# EAGLE design Encoder_Breakout (EAGLE 8.6.0)
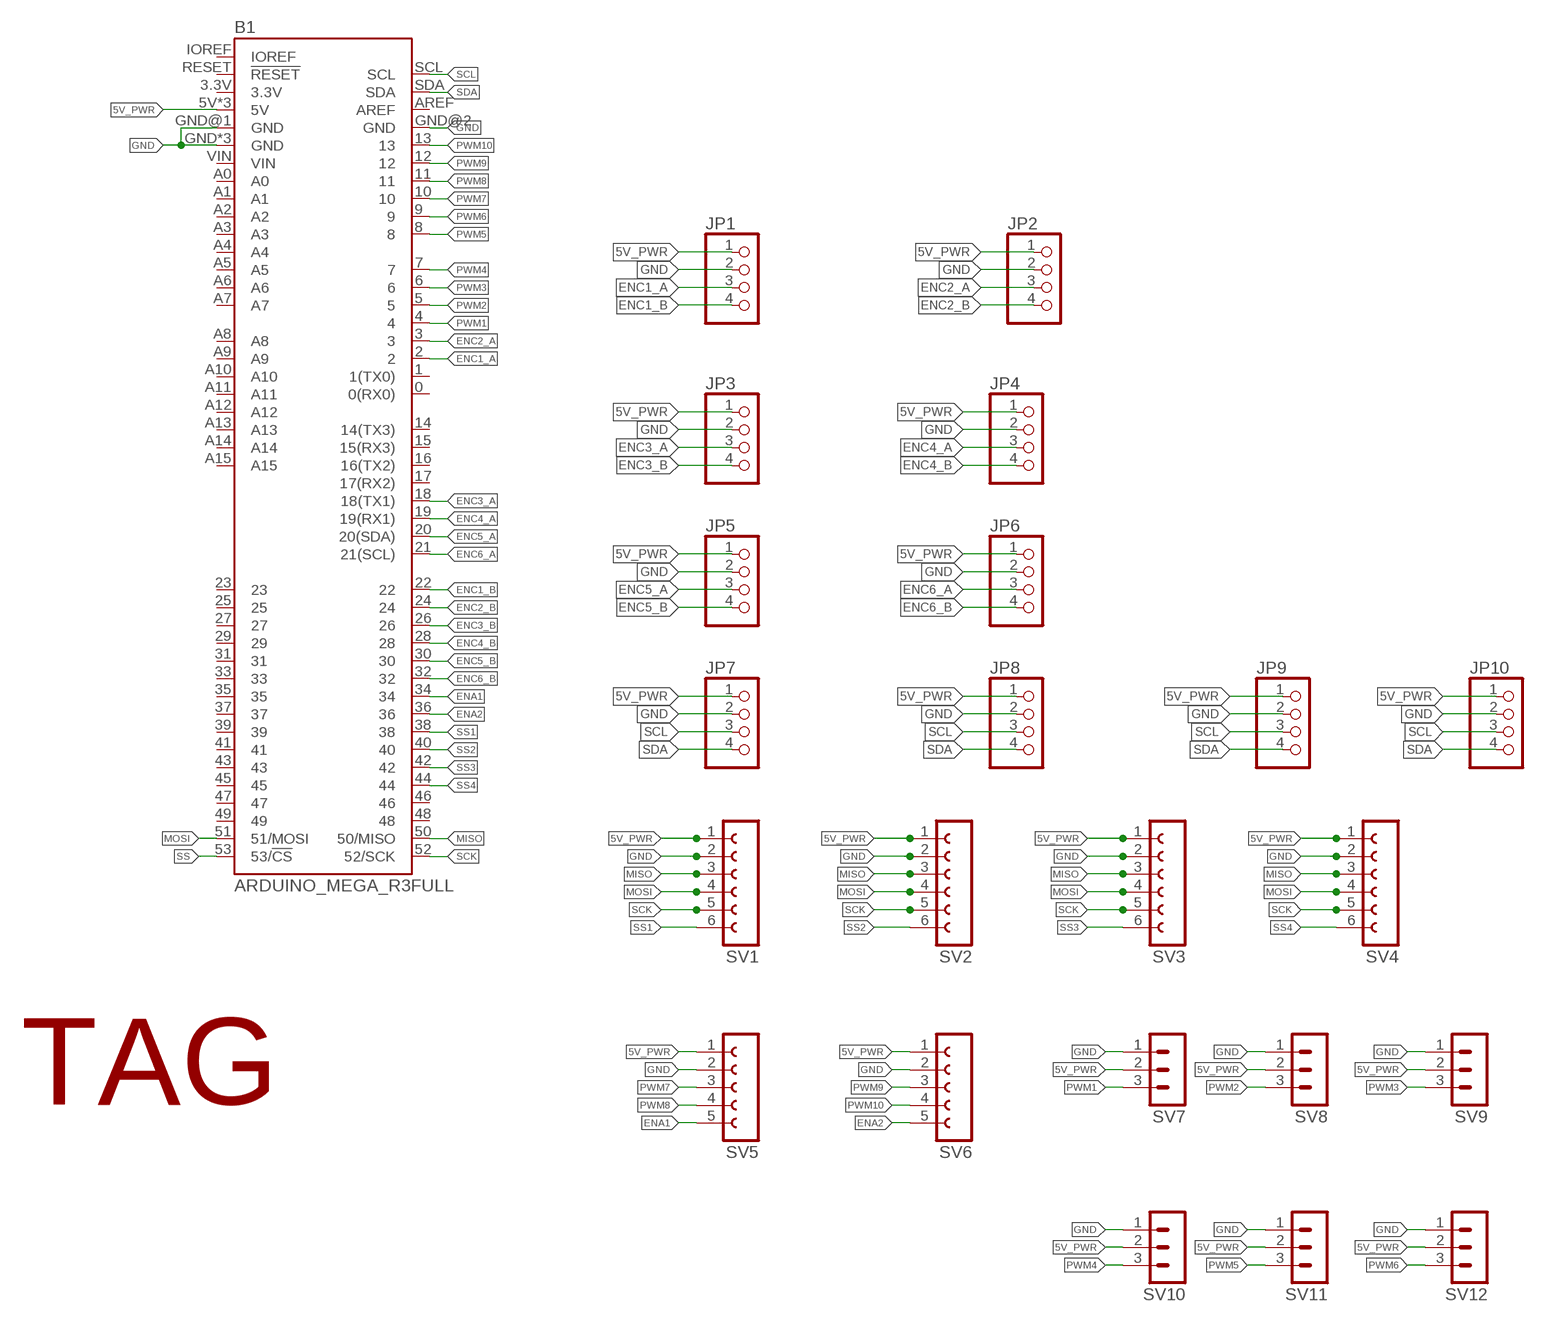
[diagram p0: schematic, sheet 1]

## Parts
B1  ARDUINO_MEGA_R3FULL  [ARDUINO_MEGA_NO_SILK]
JP1  PINHD-1X4  [1X04]
JP2  PINHD-1X4  [1X04]
JP3  PINHD-1X4  [1X04]
JP4  PINHD-1X4  [1X04]
JP5  PINHD-1X4  [1X04]
JP6  PINHD-1X4  [1X04]
JP7  PINHD-1X4  [1X04]
JP8  PINHD-1X4  [1X04]
JP9  PINHD-1X4  [1X04]
JP10  PINHD-1X4  [1X04]
SV1  FE06-1  [FE06]
SV2  FE06-1  [FE06]
SV3  FE06-1  [FE06]
SV4  FE06-1  [FE06]
SV5  FE05-1  [FE05-1]
SV6  FE05-1  [FE05-1]
SV7  MA03-1  [MA03-1]
SV8  MA03-1  [MA03-1]
SV9  MA03-1  [MA03-1]
SV10  MA03-1  [MA03-1]
SV11  MA03-1  [MA03-1]
SV12  MA03-1  [MA03-1]
U$1  TAG  [TAG]

## Nets
5V_PWR: B1.5V B1.5V@1(5V) B1.5V@2(5V) JP1.1 JP2.1 JP3.1 JP4.1 JP5.1 JP6.1 JP7.1 JP8.1 JP9.1 JP10.1 SV1.1 SV2.1 SV3.1 SV4.1 SV5.1 SV6.1 SV7.2 SV8.2 SV9.2 SV10.2 SV11.2 SV12.2
ENA1: B1.34 SV5.5
ENA2: B1.36 SV6.5
ENC1_A: B1.2 JP1.3
ENC1_B: B1.22 JP1.4
ENC2_A: B1.3 JP2.3
ENC2_B: B1.24 JP2.4
ENC3_A: B1.18(18(TX1)) JP3.3
ENC3_B: B1.26 JP3.4
ENC4_A: B1.19(19(RX1)) JP4.3
ENC4_B: B1.28 JP4.4
ENC5_A: B1.20(20(SDA)) JP5.3
ENC5_B: B1.30 JP5.4
ENC6_A: B1.21(21(SCL)) JP6.3
ENC6_B: B1.32 JP6.4
GND: B1.GND B1.GND@1(GND) B1.GND@2(GND) B1.GND@3(GND) B1.GND@4(GND) JP1.2 JP2.2 JP3.2 JP4.2 JP5.2 JP6.2 JP7.2 JP8.2 JP9.2 JP10.2 SV1.2 SV2.2 SV3.2 SV4.2 SV5.2 SV6.2 SV7.1 SV8.1 SV9.1 SV10.1 SV11.1 SV12.1
MISO: B1.50(50/MISO) SV1.3 SV2.3 SV3.3 SV4.3
MOSI: B1.51(51/MOSI) SV1.4 SV2.4 SV3.4 SV4.4
PWM1: B1.4 SV7.3
PWM2: B1.5 SV8.3
PWM3: B1.6 SV9.3
PWM4: B1.7 SV10.3
PWM5: B1.8 SV11.3
PWM6: B1.9 SV12.3
PWM7: B1.10 SV5.3
PWM8: B1.11 SV5.4
PWM9: B1.12 SV6.3
PWM10: B1.13 SV6.4
SCK: B1.52(52/SCK) SV1.5 SV2.5 SV3.5 SV4.5
SCL: B1.SCL JP7.3 JP8.3 JP9.3 JP10.3
SDA: B1.SDA JP7.4 JP8.4 JP9.4 JP10.4
SS: B1.53(53/!CS)
SS1: B1.38 SV1.6
SS2: B1.40 SV2.6
SS3: B1.42 SV3.6
SS4: B1.44 SV4.6
Unconnected: B1.0(0(RX0)) B1.1(1(TX0)) B1.3.3V B1.14(14(TX3)) B1.15(15(RX3)) B1.16(16(TX2)) B1.17(17(RX2)) B1.23 B1.25 B1.27 B1.29 B1.31 B1.33 B1.35 B1.37 B1.39 B1.41 B1.43 B1.45 B1.46 B1.47 B1.48 B1.49 B1.A0 B1.A1 B1.A2 B1.A3 B1.A4 B1.A5 B1.A6 B1.A7 B1.A8 B1.A9 B1.A10 B1.A11 B1.A12 B1.A13 B1.A14 B1.A15 B1.AREF B1.IOREF B1.RESET(!RESET) B1.VIN

## Library data of the parts
B1 = SparkFun-Boards:ARDUINO_MEGA_R3: Arduino Mega R3 ATmega2560 R3 compatible footprint. SparkFun Products: Arduino Mega 2560 R3 <https://www.sparkfun.com/products/11061>
JP1-JP10 = pinhead:PINHD-1X4: PIN HEADER
SV1-SV4 = con-lsta:FE06-1: FEMALE HEADER; OC_FARNELL: unknown; OC_NEWARK: unknown
SV5 SV6 = con-lsta:FE05-1: FEMALE HEADER; OC_FARNELL: unknown; OC_NEWARK: unknown
SV7-SV12 = con-lstb:MA03-1: PIN HEADER; OC_FARNELL: unknown; OC_NEWARK: unknown
U$1 = TAG:TAG

## Net classes
0 default: width 0.178 mm, drill 0.178 mm, clearance 0.178 mm

## Board
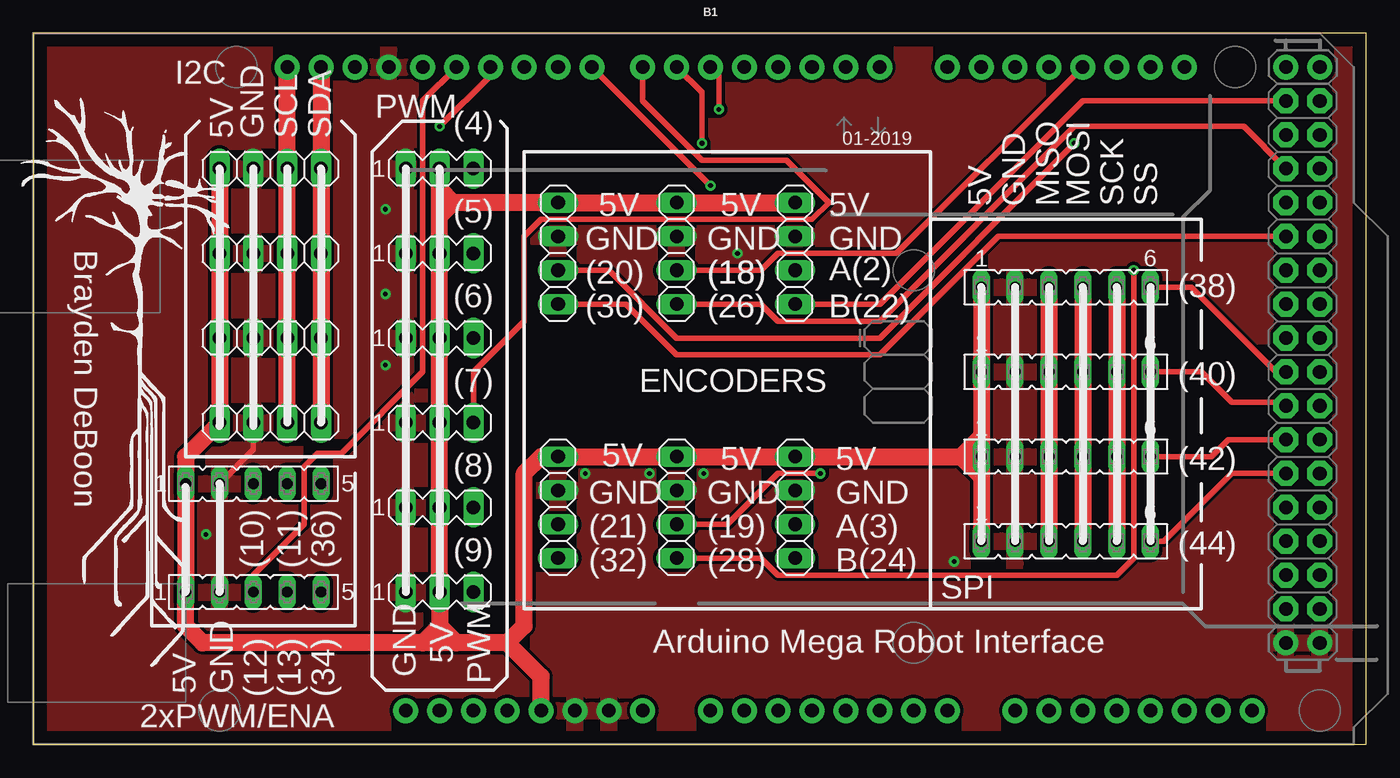
[diagram p1: board, top side]
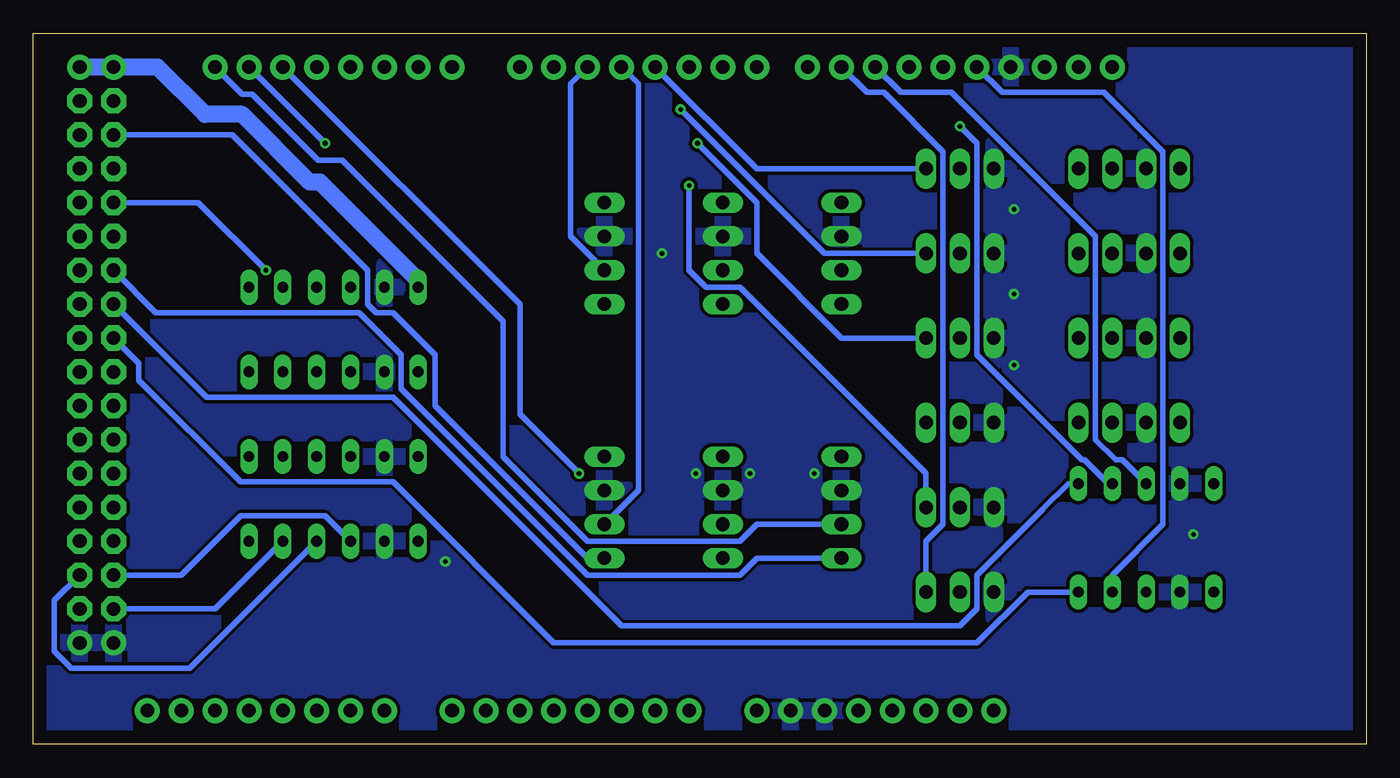
[diagram p2: board, bottom side, seen from below]

Size 100 x 53.33 mm. Coordinates in mm from the lower left corner, seen from the top.
Outline: 0,0 100,0 100,53.33 0,53.33 0,0
Copper layers (1*16): Top 0.035mm / dielectric 1.5mm / Bottom 0.035mm
Design rules "default *": minimum track width 16mil, minimum drill 0.35mm, track to track 10mil, track to pad 10mil, pad to pad 10mil, via to via 10mil, smd to smd 8mil, copper to edge 40mil, drill to drill 10mil, minimum pad ring 10mil, minimum via ring 8mil, stop-mask expansion 4mil, vias tented up to drill 0mil, thermal gap 10mil

### Footprints (pad centres in the part's own frame; a part is rotated, then mirrored left to right if it is on the bottom)
ARDUINO_MEGA_NO_SILK = drill 1.016 pad 1.88: 0 13.97,24.13; 1 11.43,24.13; 2 8.89,24.13; 3 6.35,24.13; 3.3V -13.97,-24.13; 4 3.81,24.13; 5 1.27,24.13; 5V -11.43,-24.13; 5V@1 44.45,24.13; 5V@2 46.99,24.13; 6 -1.27,24.13; 7 -3.81,24.13; 8 -7.62,24.13; 9 -10.16,24.13; 10 -12.7,24.13; 11 -15.24,24.13; 12 -17.78,24.13; 13 -20.32,24.13; 14 19.05,24.13; 15 21.59,24.13; 16 24.13,24.13; 17 26.67,24.13; 18 29.21,24.13; 19 31.75,24.13; 20 34.29,24.13; 21 36.83,24.13; A0 1.27,-24.13; A1 3.81,-24.13; A2 6.35,-24.13; A3 8.89,-24.13; A4 11.43,-24.13; A5 13.97,-24.13; A6 16.51,-24.13; A7 19.05,-24.13; A8 24.13,-24.13; A9 26.67,-24.13; A10 29.21,-24.13; A11 31.75,-24.13; A12 34.29,-24.13; A13 36.83,-24.13; A14 39.37,-24.13; A15 41.91,-24.13; AREF -25.4,24.13; GND -8.89,-24.13; GND@1 -6.35,-24.13; GND@2 44.45,-19.05; GND@3 46.99,-19.05; GND@4 -22.86,24.13; IOREF -19.05,-24.13; NC -21.59,-24.13; RESET -16.51,-24.13; SCL -30.48,24.13; SDA -27.94,24.13; VIN -3.81,-24.13 | drill 1.016 pad 1.88 octagon: 22 44.45,21.59; 23 46.99,21.59; 24 44.45,19.05; 25 46.99,19.05; 26 44.45,16.51; 27 46.99,16.51; 28 44.45,13.97; 29 46.99,13.97; 30 44.45,11.43; 31 46.99,11.43; 32 44.45,8.89; 33 46.99,8.89; 34 44.45,6.35; 35 46.99,6.35; 36 44.45,3.81; 37 46.99,3.81; 38 44.45,1.27; 39 46.99,1.27; 40 44.45,-1.27; 41 46.99,-1.27; 42 44.45,-3.81; 43 46.99,-3.81; 44 44.45,-6.35; 45 46.99,-6.35; 46 44.45,-8.89; 47 46.99,-8.89; 48 44.45,-11.43; 49 46.99,-11.43; 50 44.45,-13.97; 51 46.99,-13.97; 52 44.45,-16.51; 53 46.99,-16.51
1X04 = drill 1.016 long: 1 -3.81,0; 2 -1.27,0; 3 1.27,0; 4 3.81,0
FE06 = drill 0.813 long: 1 -6.35,0; 2 -3.81,0; 3 -1.27,0; 4 1.27,0; 5 3.81,0; 6 6.35,0
FE05-1 = drill 0.813 long: 1 -5.08,0; 2 -2.54,0; 3 0,0; 4 2.54,0; 5 5.08,0
MA03-1 = drill 1.016 long: 1 -2.54,0; 2 0,0; 3 2.54,0

### Placement (x,y rotation side)
B1  49.53,26.67 0 top
JP1  57.15,36.83 270 top
JP2  57.15,17.78 270 top
JP3  48.26,36.83 270 top
JP4  48.26,17.78 270 top
JP5  39.37,36.83 270 top
JP6  39.37,17.78 270 top
JP7  17.78,43.18 0 top
JP8  17.78,36.83 0 top
JP9  17.78,30.48 0 top
JP10  17.78,24.13 0 top
SV1  77.47,34.29 0 top
SV2  77.47,27.94 0 top
SV3  77.47,21.59 0 top
SV4  77.47,15.24 0 top
SV5  16.51,19.56 0 top
SV6  16.51,11.43 0 top
SV7  30.48,43.18 0 top
SV8  30.48,36.83 0 top
SV9  30.48,30.48 0 top
SV10  30.48,24.13 0 top
SV11  30.48,17.78 0 top
SV12  30.48,11.43 0 top
U$1  14.73,5.84 90 top

### Tracks (layer width: path | path; a pad name or v marks a point on that pad's centre or on a via)
5V_PWR
  Top 0.406: 30.73,40.64 30.48,40.64
  Top 1.27: JP7.1 JP8.1 JP9.1 JP10.1 11.43,21.59 SV5.1 SV6.1 11.43,8.89 12.7,7.62 29.21,7.62 | 30.48,39.62 SV8.2 SV9.2 SV10.2 SV11.2 SV12.2 30.48,8.89 | 30.48,39.62 30.48,40.64 SV7.2 30.48,41.66 31.5,40.64 | JP1.1 JP3.1 JP5.1 31.5,40.64 | SV1.1 SV2.1 71.12,23.11 | 71.12,23.11 SV3.1 | SV3.1 71.12,20.07 | 71.12,20.07 SV4.1 | B1.5V 38.1,5.08 35.56,7.62 | 35.56,7.62 31.75,7.62 | 31.75,7.62 30.48,7.62 | 30.48,7.62 29.21,7.62 | 30.48,8.89 30.48,7.62 | 31.75,7.62 30.48,8.89 | 30.48,8.89 29.21,7.62 | 35.56,7.62 36.83,8.89 36.83,20.32 38.1,21.59 JP6.1 JP4.1 JP2.1 69.6,21.59 | 69.6,21.59 SV3.1 | 71.12,23.11 69.6,21.59 | 69.6,21.59 71.12,20.07 | 31.5,40.64 30.73,40.64 | 31.5,40.64 30.48,39.62
  Bottom 0.406: SV1.1 73.02,36.2
  Bottom 1.27: SV1.1 71.12,34.8 78.49,42.16 79.27,42.16 84.35,47.24 87.12,47.24 90.68,50.8 B1.5V@1 B1.5V@2
ENA1
  Bottom 0.406: B1.34 86.99,26.04 73.02,26.04 55.88,8.89 30.48,8.89 29.21,10.16 29.21,12.7 24.26,17.65 24.13,17.78 22.35,19.56 SV5.5
ENA2
  Bottom 0.406: B1.36 92.08,28.57 92.08,27.3 84.45,19.68 73.02,19.68 60.96,7.62 29.21,7.62 25.4,11.43 SV6.5
ENC1_A
  Bottom 0.406: JP1.3 59.69,38.1 59.69,49.53 B1.2
ENC1_B
  Top 0.406: JP1.4 63.5,33.02 78.74,48.26 B1.22
ENC2_A
  Bottom 0.406: JP2.3 54.61,19.05 54.61,49.53 B1.3
ENC2_B
  Bottom 0.406: JP2.4 58.42,13.97 69.85,25.4 69.85,29.21 73.02,32.38 74.3,32.38 74.93,33.02 74.93,35.56 85.09,45.72 B1.24
ENC3_A
  Top 0.406: JP3.3 54.61,35.56 55.88,36.83 64.77,36.83 B1.18
ENC3_B
  Top 0.406: JP3.4 54.61,33.02 55.88,31.75 63.5,31.75 78.1,46.35 90.8,46.35 B1.26
ENC4_A  (via drill 0.35)
  Top 0.406: JP4.3 52.07,16.51 55.88,20.32 v59.05,20.32
  Bottom 0.406: v59.05,20.32 63.5,24.77 63.5,33.02 B1.19
ENC4_B  (via drill 0.35)
  Top 0.406: JP4.4 54.61,13.97 55.88,12.7 81.28,12.7 82.55,13.97 v82.55,35.56
  Bottom 0.406: v82.55,35.56 87.63,40.64 B1.28
ENC5_A  (via drill 0.35)
  Top 0.406: JP5.3 43.18,35.56 48.26,30.48 63.5,30.48 v78.1,45.09
  Bottom 0.406: B1.20 v78.1,45.09
ENC5_B
  Top 0.406: JP5.4 44.45,33.02 48.26,29.21 63.5,29.21 72.39,38.1 B1.30
ENC6_A
  Bottom 0.406: JP6.3 45.72,16.51 46.99,15.24 58.42,15.24 64.77,21.59 64.77,31.75 76.83,43.81 78.61,43.81 83.57,48.77 84.33,48.77 B1.21
ENC6_B
  Bottom 0.406: JP6.4 45.72,13.97 46.99,12.7 58.42,12.7 72.39,26.67 72.39,29.21 75.56,32.38 90.8,32.38 B1.32
GND  (via drill 0.35)
  Top 0.406: SV5.2 16.51,22.1 JP10.2
  other vias: 12.95,15.75 26.42,40.13 26.42,33.78 26.42,28.45 52.83,36.83 41.4,20.32 46.23,20.32 50.29,20.32 69.09,13.72
  pour Top: 0,53.34 0,0 100.33,0 100.33,53.34
  pour Bottom: 0,53.34 0,0 100.33,0 100.33,53.34
MISO
  Top 1.27: SV1.3 SV2.3 SV3.3 SV4.3
  Bottom 0.406: B1.50 88.9,12.7 84.45,17.14 78.1,17.14 SV4.3
MOSI
  Top 1.27: SV1.4 SV2.4 SV3.4 SV4.4
  Bottom 0.406: B1.51 98.42,10.79 98.42,6.99 97.16,5.71 88.27,5.71 SV4.4
PWM1
  Bottom 0.406: SV7.3 45.72,43.18 B1.4
PWM2  (via drill 0.35)
  Top 0.406: v51.44,47.62 51.44,50.16 B1.5
  Bottom 0.406: SV8.3 40.64,36.83 v51.44,47.62
PWM3  (via drill 0.35)
  Top 0.406: v50.17,45.09 50.17,48.9 B1.6
  Bottom 0.406: SV9.3 39.37,30.48 45.72,36.83 45.72,40.64 v50.17,45.09
PWM4
  Top 0.406: SV10.3 33.02,27.94 36.83,31.75 36.83,38.1 38.1,39.37 58.42,39.37 59.69,40.64 56.52,43.81 50.17,43.81 45.72,48.26 B1.7
PWM5  (via drill 0.35)
  Top 0.406: B1.8 v50.8,41.91
  Bottom 0.406: SV11.3 33.02,20.32 46.99,34.29 49.53,34.29 50.8,35.56 v50.8,41.91
PWM6
  Bottom 0.406: SV12.3 33.02,15.24 31.75,16.51 31.75,44.45 36.2,48.9 37.47,48.9 B1.9
PWM7
  Bottom 0.406: B1.10 34.93,48.9 31.11,48.9 20.32,38.1 20.32,22.86 18.8,21.34 18.29,21.34 SV5.3
PWM8  (via drill 0.35)
  Top 0.406: v30.48,46.35 34.29,50.16 B1.11
  Bottom 0.406: v30.48,46.35 29.21,45.09 29.21,29.21 21.34,21.34 21.13,21.34 19.35,19.56 SV5.4
PWM9
  Top 0.406: SV6.3 16.51,12.7 20.32,16.51 20.32,20.83 21.34,21.84 23.11,21.84 29.21,27.94 29.21,48.26 B1.12
PWM10
  Bottom 0.406: B1.13 27.3,48.9 19.68,48.9 15.24,44.45 15.24,16.51 19.05,12.7 SV6.4
SCK
  Top 1.27: SV1.5 SV2.5 SV3.5 SV4.5
  Bottom 0.406: B1.52 86.36,10.16 SV4.5
SCL
  Top 1.27: JP10.3 JP9.3 JP8.3 JP7.3 B1.SCL
SDA
  Top 1.27: B1.SDA JP7.4 JP8.4 JP9.4 JP10.4
SS1
  Top 0.406: B1.38 93.22,27.94 86.87,34.29 SV1.6
SS2
  Top 0.406: B1.40 93.73,25.65 89.92,25.65 87.63,27.94 SV2.6
SS3
  Top 0.406: B1.42 89.66,22.86 88.39,21.59 SV3.6
SS4
  Top 0.406: B1.44 89.92,20.32 84.84,15.24 SV4.6

### Text on the board
tPlace: I2C | PWM | (4) | 5V | GND | SCL | SDA | 01-2019 | 5V | 5V | 5V | 5V | GND | MISO | MOSI | SCK | SS | (5) | Brayden DeBoon | GND | GND | GND | (20) | (18) | (18) | A(2) | (38) | (6) | (30) | (26) | B(22) | (40) | (7) | ENCODERS | 5V | 5V | 5V | (42) | (8) | GND | GND | GND | (21) | (19) | A(3) | (9) | (44) | (10) | (11) | (36) | (32) | (28) | B(24) | SPI | Arduino Mega Robot Interface | 5V | GND | PWM | 5V | GND | (12) | (13) | (34) | 2xPWM/ENA